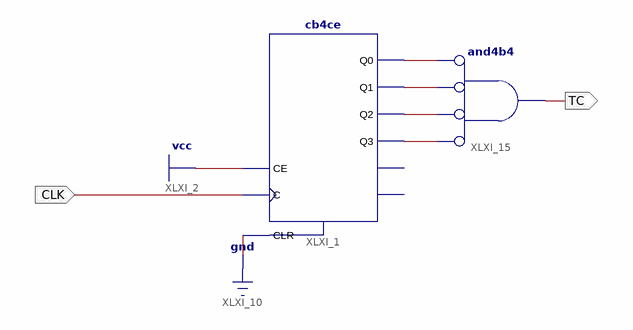
[diagram p0: schematic sheet 1]
// Xilinx ISE schematic Counter16_TC.sch (spartan6) as structural Verilog: 2 symbols, 2 ports
module Counter16_TC (
  input  CLK,
  output TC
);

  wire XLXN_23, XLXN_24, XLXN_25, XLXN_26;

  cb4ce XLXI_1 (
    .C(CLK), .CE(1'b1), .CLR(1'b0), .Q0(XLXN_23), .Q1(XLXN_24), .Q2(XLXN_25), .Q3(XLXN_26));  // open: CEO, TC
  and XLXI_15 (TC, ~XLXN_26, ~XLXN_25, ~XLXN_24, ~XLXN_23);  // and4b4
endmodule
